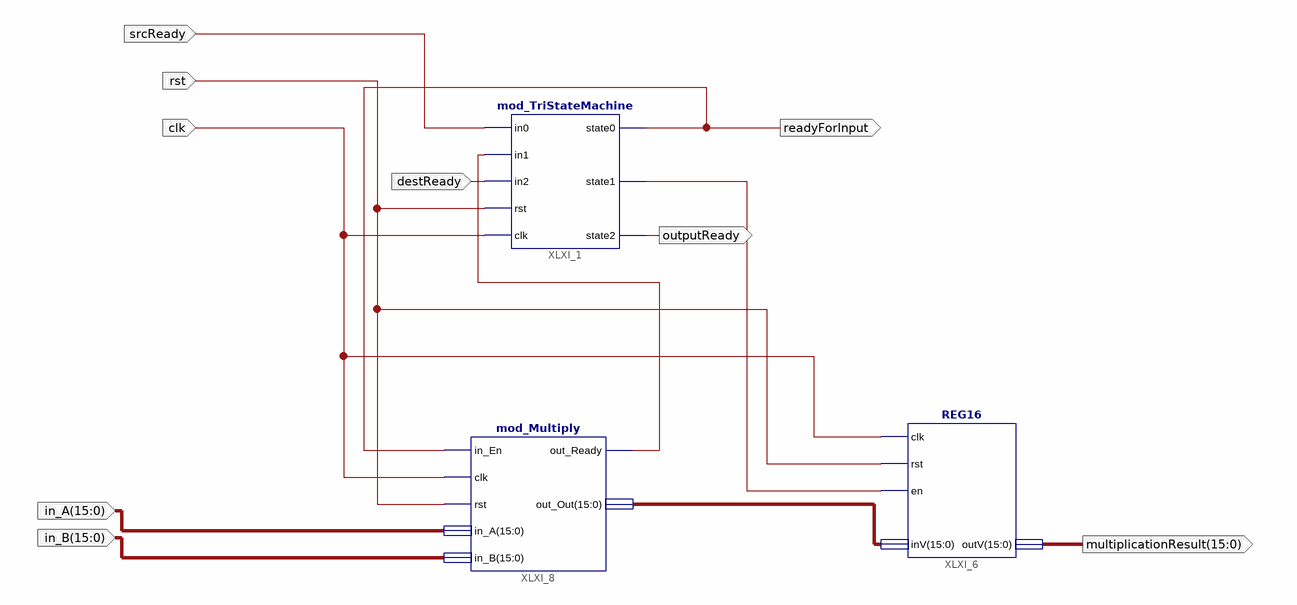
[diagram p0: schematic sheet 1]
// Xilinx ISE schematic mod_MulStageNEW.sch (spartan3e) as structural Verilog: 3 symbols, 9 ports
module mod_MulStageNEW (
  input  rst,
  input  clk,
  input  srcReady,
  input  [15:0] in_A,
  input  [15:0] in_B,
  input  destReady,
  output readyForInput,
  output outputReady,
  output [15:0] multiplicationResult
);

  wire out_Ready, state1;
  wire [15:0] XLXN_1;

  mod_TriStateMachine XLXI_1 (
    .in0(srcReady), .in1(out_Ready), .in2(destReady), .rst(rst), .clk(clk), .state0(readyForInput),
    .state1(state1), .state2(outputReady));
  REG16 XLXI_6 (.clk(clk), .rst(rst), .en(state1), .inV(XLXN_1), .outV(multiplicationResult));
  mod_Multiply XLXI_8 (
    .in_En(readyForInput), .clk(clk), .rst(rst), .in_A(in_A), .in_B(in_B), .out_Ready(out_Ready),
    .out_Out(XLXN_1));
endmodule
